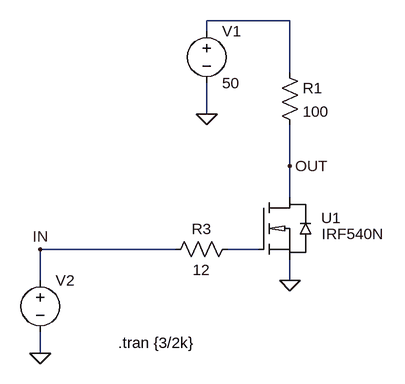
[diagram p0: schematic IRF540N.asc]
IRF540N.asc, the LTspice schematic file:
Version 4.1
SHEET 1 880 680
WIRE 304 -128 176 -128
WIRE 176 -112 176 -128
WIRE 304 -48 304 -128
WIRE 176 16 176 -32
WIRE 304 96 304 32
WIRE 304 144 304 96
WIRE 128 224 -80 224
WIRE 256 224 208 224
WIRE -80 272 -80 224
WIRE 304 272 304 240
WIRE -80 384 -80 352
FLAG 304 272 0
FLAG 176 16 0
FLAG -80 384 0
FLAG -80 224 IN
FLAG 304 96 OUT
SYMBOL res 288 -64 R0
SYMATTR InstName R1
SYMATTR Value 100
SYMBOL voltage 176 -128 R0
WINDOW 123 0 0 Left 0
WINDOW 39 0 0 Left 0
SYMATTR InstName V1
SYMATTR Value 50
SYMBOL voltage -80 256 R0
WINDOW 3 41 64 Invisible 2
WINDOW 123 0 0 Left 0
WINDOW 39 0 0 Left 0
SYMATTR Value PULSE(0 15 0 1n 1n {0.5/2k} {1/2k})
SYMATTR InstName V2
SYMBOL MyLib\\Transistor_MOSFET_N\\IRF540N 256 144 R0
SYMATTR InstName U1
SYMBOL res 224 208 R90
WINDOW 0 0 56 VBottom 2
WINDOW 3 32 56 VTop 2
SYMATTR InstName R3
SYMATTR Value 12
TEXT 40 368 Left 2 !.tran {3/2k}

The netlist it stands for:
* IRF540N.asc
R1 N001 OUT 100
V1 N001 0 50
V2 IN 0 PULSE(0 15 0 1n 1n {0.5/2k} {1/2k})
X§U1 OUT N002 0 IRF540N  ; pins D G S
R3 N002 IN 12
.tran {3/2k}
.lib MyLib/Transistor_MOSFET_N/IRF540N.lib
.backanno
.end